# Altium schematic sheet uInverter_02.SchDoc
size A; SheetNumber: 1; SheetTotal: 4
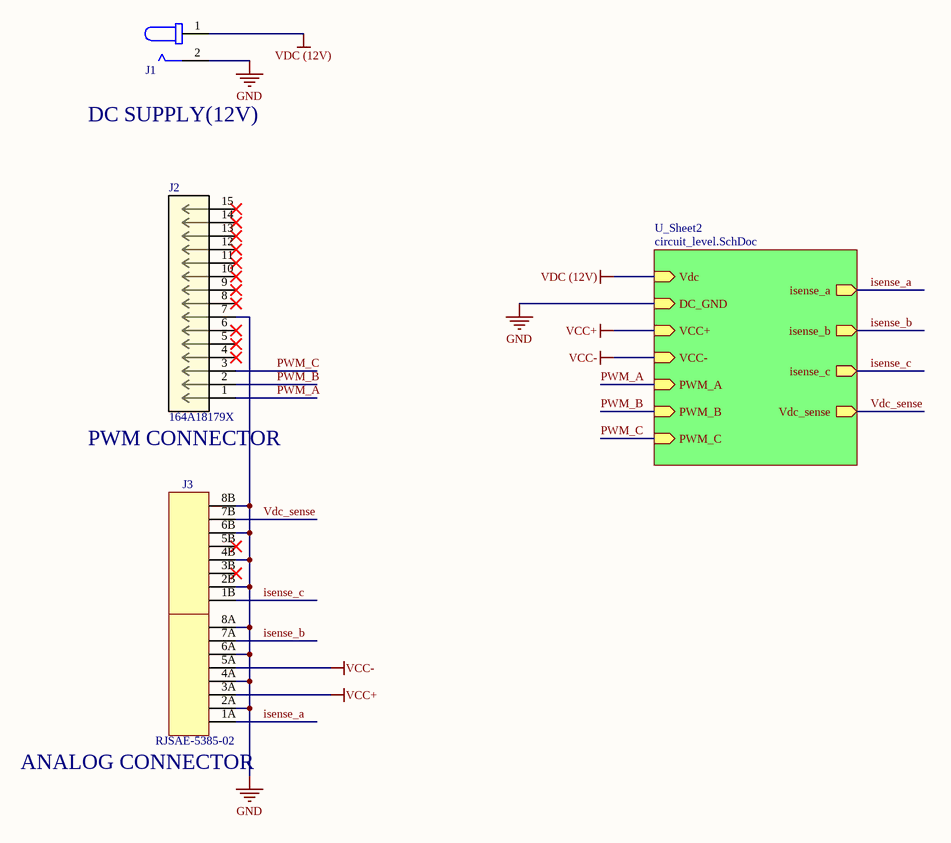
[diagram p0: uInverter_02.SchDoc]

## Parts
J1  PJ-037AH  (value not drawn)
J2  164A18179X
J3  RJSAE-5385-02

## Sub-sheets
U_Sheet2 = circuit_level.SchDoc: PWM_A (in), PWM_B (in), PWM_C (in), VCC+ (in), VCC- (in), Vdc (in), DC_GND (in), isense_b (out), isense_c (out), Vdc_sense (out), isense_a (out)

## Nets
GND: J1.2 J2.7 J3.2A J3.2B J3.4A J3.4B J3.6A J3.6B J3.8A J3.8B ; sheet U_Sheet2/DC_GND
VCC+: J3.3A ; sheet U_Sheet2/VCC+
VCC-: J3.5A ; sheet U_Sheet2/VCC-
VDC (12V): J1.1 ; sheet U_Sheet2/Vdc
isense_a: J3.1A ; sheet U_Sheet2/isense_a
isense_b: J3.7A ; sheet U_Sheet2/isense_b
isense_c: J3.1B ; sheet U_Sheet2/isense_c
PWM_A: J2.1 ; sheet U_Sheet2/PWM_A
PWM_B: J2.2 ; sheet U_Sheet2/PWM_B
PWM_C: J2.3 ; sheet U_Sheet2/PWM_C
Vdc_sense: J3.7B ; sheet U_Sheet2/Vdc_sense

Not connected (* = marked no-connect by the designer): J2 4* 5* 6* 8* 9* 10* 11* 12* 13* 14* 15*; J3 3B(79)* 5B(79)*

## Notes on the sheet
- (near J1) DC SUPPLY(12V)
- (near J2) PWM CONNECTOR
- (near J3) ANALOG CONNECTOR

## Library data of the parts
J1 = PJ-037AH: CONN PWR JACK 2X5.5MM SOLDER; Manufacturer: CUI; Shielding: Unshielded; Gender: Male; Current Rating: 5A; Number of Conductors: 2; Voltage Rating: 24V; Insulation Resistance: 100MR; Supplier 1: Digi-Key; Manufacturer Part Number: PJ-037AH; RoHS: Yes; Category: Connectors; Stock 1: 11304; Pricing 1: 1=0.71000, 10=0.66600, 25=0.59920, 50=0.53280, 100=0.51060, 250=0.46620, 500=0.44400, 1000=0.36630, 2500=0.33300 (USD); Mount: Through Hole; Color: Black; Contact Material: Copper; Contact Plating: Nickel; Housing Color: Black; Housing Material: Thermoplastic; Min Operating Temperature: -25°C; Max Operating Temperature: 85°C; Connector Type: Jack; Termination: Solder; Package Quantity: 500; Contact Gender: Male; Orientation: Horizontal; Series: -; Flammability Rating: UL94 V-0; Lead Free: Lead Free; RoHS Compliant: Yes; ComponentLink1URL: http://www.mouser.com/ds/2/670/pj-037ah-516064.pdf?src-supplier=Mouser; ComponentLink1Description: http://www.mouser.com/ds/2/670/pj-037ah-516064.pdf?src-supplier=Mouser; ComponentLink2URL: https://www.cui.com/product/resource/digikeypdf/pj-037ah.pdf?src-supplier=Digi-Key; ComponentLink2Description: https://www.cui.com/product/resource/digikeypdf/pj-037ah.pdf?src-supplier=Digi-Key; Supplier Part Number 1: CP-037AH-ND
J2 = 164A18179X: CONN DSUB HD RCPT 15POS R/A SLDR; Manufacturer: Conec; Plating: Tin; Number of Terminals/Pins: 15; Current Rating: 3A; Max Supply Voltage: 60V; Gender: Female; Connector Type: D-Sub,Receptacle,Signal; Number of Ports: 1; Ratings: IP20; Supplier 1: Digi-Key; Manufacturer Part Number: 164A18179X; RoHS: Yes; Category: D-Sub Connectors; Stock 1: 177; Pricing 1: 1=16.21000, 10=15.05400, 25=13.51000, 50=13.12400, 100=11.58000, 250=10.80800, 500=10.57640, 1000=10.03600 (USD); Mount: Through Hole; Contact Plating: Gold; Contact Material: Copper Alloy; Housing Material: PBT; Color: Black; Housing Color: Black; Min Operating Temperature: -55°C; Max Operating Temperature: 105°C; Number of Rows: 3; Package Quantity: 30; Voltage Rating: 60V; Packaging: Tray; Number of Positions: 15; Termination: Solder; Orientation: Right Angle; Length: 31.19mm; Radiation Hardening: No; Flammability Rating: UL94 V-0; Lead Free: Lead Free; ComponentLink1URL: https://datasheet.ciiva.com/15178/getdatasheetpartid-349132-15178123.pdf?src-supplier=Verical; ComponentLink1Description: https://datasheet.ciiva.com/15178/getdatasheetpartid-349132-15178123.pdf?src-supplier=Verical; Supplier Part Number 1: 626-1062-ND
J3 = RJSAE-5385-02: CONN MOD JACK 8P8C R/A SHIELDED; Manufacturer: Amphenol Commercial; Number of Contacts: 16; Gender: Female; Current Rating: 1.5A; Voltage Rating: 125V; Number of Ports: 2; Direction: Up and Down; Pitch: 2.54mm; Supplier 1: Digi-Key; Manufacturer Part Number: RJSAE-5385-02; RoHS: Yes; Category: Modular / Ethernet Connectors; Stock 1: 254; Pricing 1: 1=6.67000, 10=6.39000, 25=5.83440, 50=5.55660, 100=5.27880, 250=4.72312, 500=4.44528, 1000=4.01310 (USD); Mount: Through Hole; Color: Black,Green; Contact Plating: Gold; Contact Material: Bronze; Housing Material: Thermoplastic; Min Operating Temperature: -55°C; Max Operating Temperature: 85°C; Termination: Solder; Orientation: Right Angle; Package Quantity: 35; Packaging: Tray; Shielding: Shielded; Number of Rows: 2; Number of Positions Loaded: 16; Connector Type: Jack; Series: RJSAE; Length: 16.51mm; Depth: 28.15mm; Radiation Hardening: No; Lead Free: Lead Free; RoHS Compliant: Yes; ComponentLink1URL: https://datasheet.ciiva.com/26934/getdatasheetpartid-29521-26934348.pdf?src-supplier=Verical; ComponentLink1Description: https://datasheet.ciiva.com/26934/getdatasheetpartid-29521-26934348.pdf?src-supplier=Verical; Supplier Part Number 1: RJSAE-5385-02-ND